# Altium project DataMergeBoard.PrjPcb
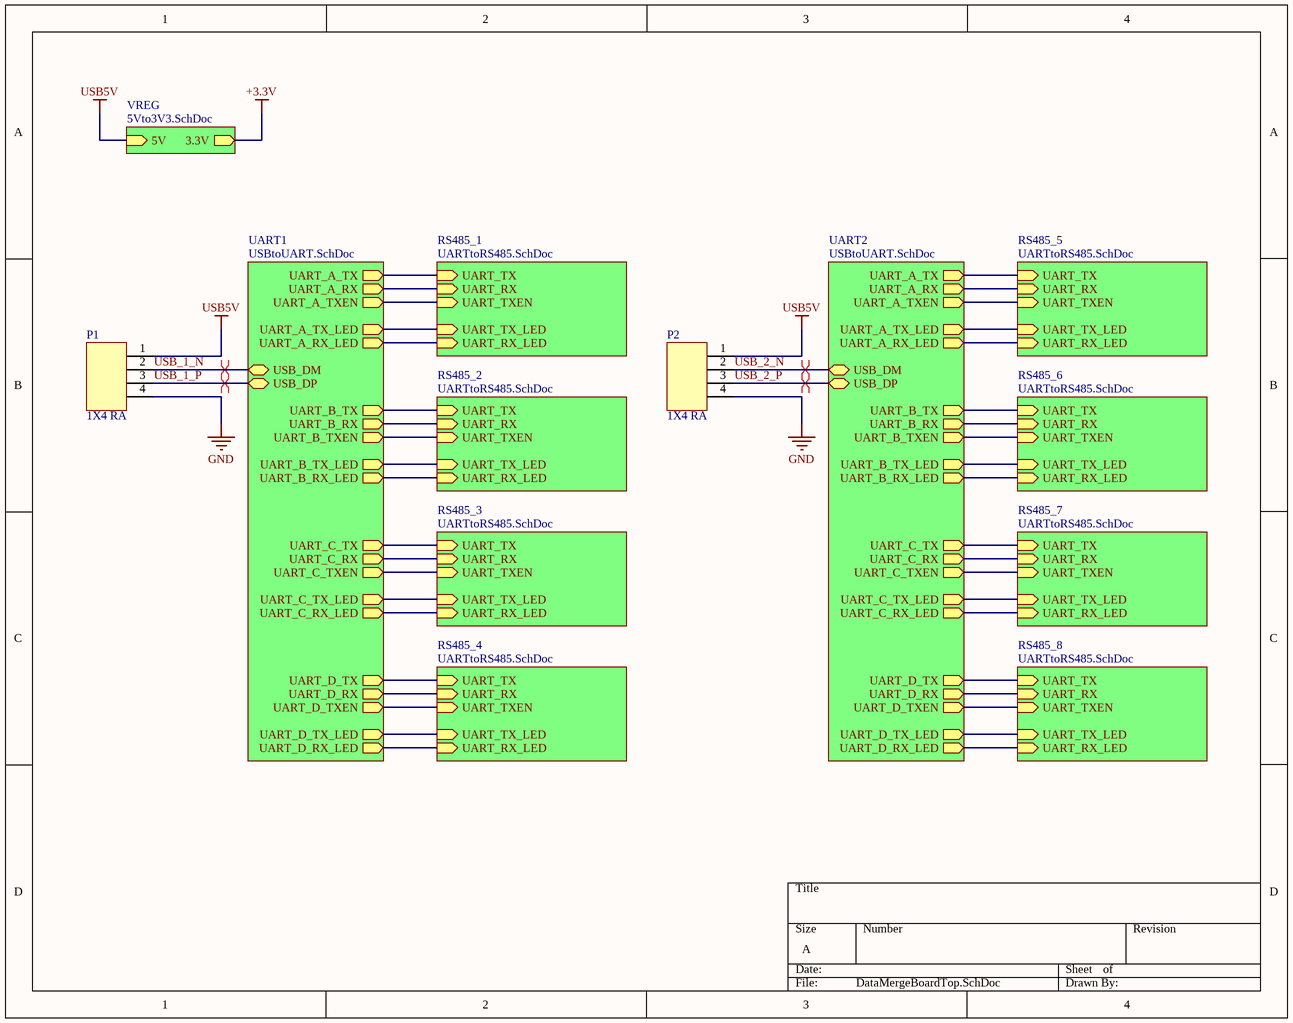
[diagram p0: DataMergeBoardTop.SchDoc]
4 sheets, 115 parts. Net scope: hierarchical (ports join the sheet entries above them; power ports are global).
Board file: DataMergeBoard.PcbDoc
Sheets:
  DataMergeBoardTop.SchDoc
    RS485_1 = UARTtoRS485.SchDoc
    UART1 = USBtoUART.SchDoc
    VREG = 5Vto3V3.SchDoc
    RS485_2 = UARTtoRS485.SchDoc
    RS485_3 = UARTtoRS485.SchDoc
    RS485_4 = UARTtoRS485.SchDoc
    RS485_5 = UARTtoRS485.SchDoc
    UART2 = USBtoUART.SchDoc
    RS485_6 = UARTtoRS485.SchDoc
    RS485_7 = UARTtoRS485.SchDoc
    RS485_8 = UARTtoRS485.SchDoc

## Sheet DataMergeBoardTop.SchDoc
size A

### Parts
P1  1X4 RA  [MOLEX-HDR-1X4-SHERLOCK-RA]
P2  1X4 RA  [MOLEX-HDR-1X4-SHERLOCK-RA]

### Sub-sheets
RS485_1 = UARTtoRS485.SchDoc: UART_TX (in), UART_RX (in), UART_TXEN (in), UART_RX_LED (in), UART_TX_LED (in)
RS485_2 = UARTtoRS485.SchDoc: UART_TX (in), UART_RX (in), UART_TXEN (in), UART_RX_LED (in), UART_TX_LED (in)
RS485_3 = UARTtoRS485.SchDoc: UART_TX (in), UART_RX (in), UART_TXEN (in), UART_RX_LED (in), UART_TX_LED (in)
RS485_4 = UARTtoRS485.SchDoc: UART_TX (in), UART_RX (in), UART_TXEN (in), UART_RX_LED (in), UART_TX_LED (in)
RS485_5 = UARTtoRS485.SchDoc: UART_TX (in), UART_RX (in), UART_TXEN (in), UART_RX_LED (in), UART_TX_LED (in)
RS485_6 = UARTtoRS485.SchDoc: UART_TX (in), UART_RX (in), UART_TXEN (in), UART_RX_LED (in), UART_TX_LED (in)
RS485_7 = UARTtoRS485.SchDoc: UART_TX (in), UART_RX (in), UART_TXEN (in), UART_RX_LED (in), UART_TX_LED (in)
RS485_8 = UARTtoRS485.SchDoc: UART_TX (in), UART_RX (in), UART_TXEN (in), UART_RX_LED (in), UART_TX_LED (in)
UART1 = USBtoUART.SchDoc: UART_A_TX (out), UART_A_RX (out), UART_A_TXEN (out), UART_B_RX (out), UART_B_TX (out), UART_B_TXEN (out), UART_C_RX (out), UART_C_TX (out), UART_C_TXEN (out), UART_D_RX (out), UART_D_TX (out), UART_D_TXEN (out), USB_DP (bidir), USB_DM (bidir), UART_A_TX_LED (out), UART_A_RX_LED (out), UART_B_TX_LED (out), UART_C_TX_LED (out), UART_D_TX_LED (out), UART_B_RX_LED (out), UART_C_RX_LED (out), UART_D_RX_LED (out)
UART2 = USBtoUART.SchDoc: UART_A_TX (out), UART_A_RX (out), UART_A_TXEN (out), UART_B_RX (out), UART_B_TX (out), UART_B_TXEN (out), UART_C_RX (out), UART_C_TX (out), UART_C_TXEN (out), UART_D_RX (out), UART_D_TX (out), UART_D_TXEN (out), USB_DM (bidir), USB_DP (bidir), UART_A_TX_LED (out), UART_A_RX_LED (out), UART_B_TX_LED (out), UART_C_TX_LED (out), UART_D_TX_LED (out), UART_B_RX_LED (out), UART_C_RX_LED (out), UART_D_RX_LED (out)
VREG = 5Vto3V3.SchDoc: 5V (in), 3.3V (out)

### Nets
GND: P1.4 P2.4
USB5V: P1.1 P2.1 ; sheet VREG/5V
USB_1_N: P1.2 ; sheet UART1/USB_DM
USB_1_P: P1.3 ; sheet UART1/USB_DP
USB_2_N: P2.2 ; sheet UART2/USB_DM
USB_2_P: P2.3 ; sheet UART2/USB_DP
NetR2_RS485_1_1: sheet RS485_1/UART_TX_LED, sheet UART1/UART_A_TX_LED
NetR2_RS485_2_1: sheet UART1/UART_B_TX_LED, sheet RS485_2/UART_TX_LED
NetR2_RS485_3_1: sheet UART1/UART_C_TX_LED, sheet RS485_3/UART_TX_LED
NetR2_RS485_4_1: sheet UART1/UART_D_TX_LED, sheet RS485_4/UART_TX_LED
NetR2_RS485_5_1: sheet RS485_5/UART_TX_LED, sheet UART2/UART_A_TX_LED
NetR2_RS485_6_1: sheet UART2/UART_B_TX_LED, sheet RS485_6/UART_TX_LED
NetR2_RS485_7_1: sheet UART2/UART_C_TX_LED, sheet RS485_7/UART_TX_LED
NetR2_RS485_8_1: sheet UART2/UART_D_TX_LED, sheet RS485_8/UART_TX_LED
NetR3_RS485_1_1: sheet RS485_1/UART_RX_LED, sheet UART1/UART_A_RX_LED
NetR3_RS485_2_1: sheet UART1/UART_B_RX_LED, sheet RS485_2/UART_RX_LED
NetR3_RS485_3_1: sheet UART1/UART_C_RX_LED, sheet RS485_3/UART_RX_LED
NetR3_RS485_4_1: sheet UART1/UART_D_RX_LED, sheet RS485_4/UART_RX_LED
NetR3_RS485_5_1: sheet RS485_5/UART_RX_LED, sheet UART2/UART_A_RX_LED
NetR3_RS485_6_1: sheet UART2/UART_B_RX_LED, sheet RS485_6/UART_RX_LED
NetR3_RS485_7_1: sheet UART2/UART_C_RX_LED, sheet RS485_7/UART_RX_LED
NetR3_RS485_8_1: sheet UART2/UART_D_RX_LED, sheet RS485_8/UART_RX_LED
NetU1_RS485_1_1: sheet RS485_1/UART_RX, sheet UART1/UART_A_RX
NetU1_RS485_1_2: sheet RS485_1/UART_TXEN, sheet UART1/UART_A_TXEN
NetU1_RS485_1_4: sheet RS485_1/UART_TX, sheet UART1/UART_A_TX
NetU1_RS485_2_1: sheet UART1/UART_B_RX, sheet RS485_2/UART_RX
NetU1_RS485_2_2: sheet UART1/UART_B_TXEN, sheet RS485_2/UART_TXEN
NetU1_RS485_2_4: sheet UART1/UART_B_TX, sheet RS485_2/UART_TX
NetU1_RS485_3_1: sheet UART1/UART_C_RX, sheet RS485_3/UART_RX
NetU1_RS485_3_2: sheet UART1/UART_C_TXEN, sheet RS485_3/UART_TXEN
NetU1_RS485_3_4: sheet UART1/UART_C_TX, sheet RS485_3/UART_TX
NetU1_RS485_4_1: sheet UART1/UART_D_RX, sheet RS485_4/UART_RX
NetU1_RS485_4_2: sheet UART1/UART_D_TXEN, sheet RS485_4/UART_TXEN
NetU1_RS485_4_4: sheet UART1/UART_D_TX, sheet RS485_4/UART_TX
NetU1_RS485_5_1: sheet RS485_5/UART_RX, sheet UART2/UART_A_RX
NetU1_RS485_5_2: sheet RS485_5/UART_TXEN, sheet UART2/UART_A_TXEN
NetU1_RS485_5_4: sheet RS485_5/UART_TX, sheet UART2/UART_A_TX
NetU1_RS485_6_1: sheet UART2/UART_B_RX, sheet RS485_6/UART_RX
NetU1_RS485_6_2: sheet UART2/UART_B_TXEN, sheet RS485_6/UART_TXEN
NetU1_RS485_6_4: sheet UART2/UART_B_TX, sheet RS485_6/UART_TX
NetU1_RS485_7_1: sheet UART2/UART_C_RX, sheet RS485_7/UART_RX
NetU1_RS485_7_2: sheet UART2/UART_C_TXEN, sheet RS485_7/UART_TXEN
NetU1_RS485_7_4: sheet UART2/UART_C_TX, sheet RS485_7/UART_TX
NetU1_RS485_8_1: sheet UART2/UART_D_RX, sheet RS485_8/UART_RX
NetU1_RS485_8_2: sheet UART2/UART_D_TXEN, sheet RS485_8/UART_TXEN
NetU1_RS485_8_4: sheet UART2/UART_D_TX, sheet RS485_8/UART_TX

### Layout directives
differential pair: USB_1_N, USB_1_P, USB_2_N, USB_2_P

### Library data of the parts
P1 P2 = MOLEX-HDR-1x4-SHERLOCK_RA: CONN HEADER 4POS 2MM R/A TIN; Supplier Part Number 1: WM18933-ND; Supplier 1: Digi-Key

## Sheet UARTtoRS485.SchDoc
size A
Used 8 times, as channels RS485_1, RS485_2, RS485_3, RS485_4, RS485_5, RS485_6, RS485_7, RS485_8. Parts and nets are listed once, with the designators drawn on the sheet.
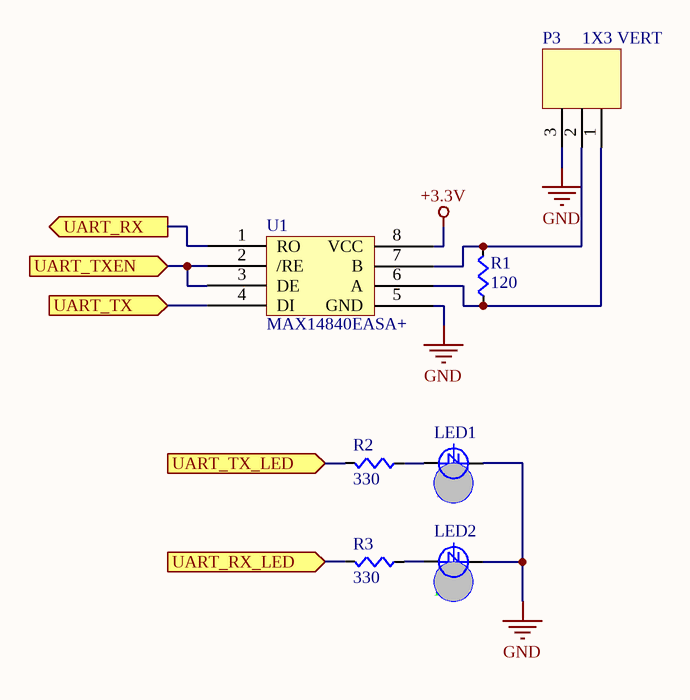
[diagram p1: UARTtoRS485.SchDoc]

### Parts
LED1  Color: TX  [LED0603]  (hidden comment: LED)
LED2  Color: RX  [LED0603]  (hidden comment: LED)
P3  1X3 VERT  [MOLEX-HDR-1X3-SHERLOCK-VERT]
R1  value 120  [RES0603]  (hidden comment: Res)
R2  value 330  [RES0603]  (hidden comment: Res)
R3  value 330  [RES0603]  (hidden comment: Res)
U1  MAX14840EASA+  [MAX14840EASA+]

### Ports
UART_RX (out), UART_RX_LED (in), UART_TX (in), UART_TX_LED (in), UART_TXEN (in)

### Nets
+3.3V: U1.8(VCC)
GND: LED1.C LED2.C P3.3 U1.5(GND)
UART_RX: U1.1(RO) ; port UART_RX
UART_RX_LED: R3.1(A) ; port UART_RX_LED
UART_TX: U1.4(DI) ; port UART_TX
UART_TX_LED: R2.1(A) ; port UART_TX_LED
UART_TXEN: U1.2(/RE) U1.3(DE) ; port UART_TXEN
NetLED1_A: LED1.A R2.2(B)
NetLED2_A: LED2.A R3.2(B)
NetP3_1: P3.1 R1.2(B) U1.6(A)
NetP3_2: P3.2 R1.1(A) U1.7(B)

### Channels
RS485_1: designators end in _RS485_1; ports UART_RX=NetU1_RS485_1_1 UART_RX_LED=NetR3_RS485_1_1 UART_TX=NetU1_RS485_1_4 UART_TX_LED=NetR2_RS485_1_1 UART_TXEN=NetU1_RS485_1_2
RS485_2: designators end in _RS485_2; ports UART_RX=NetU1_RS485_2_1 UART_RX_LED=NetR3_RS485_2_1 UART_TX=NetU1_RS485_2_4 UART_TX_LED=NetR2_RS485_2_1 UART_TXEN=NetU1_RS485_2_2
RS485_3: designators end in _RS485_3; ports UART_RX=NetU1_RS485_3_1 UART_RX_LED=NetR3_RS485_3_1 UART_TX=NetU1_RS485_3_4 UART_TX_LED=NetR2_RS485_3_1 UART_TXEN=NetU1_RS485_3_2
RS485_4: designators end in _RS485_4; ports UART_RX=NetU1_RS485_4_1 UART_RX_LED=NetR3_RS485_4_1 UART_TX=NetU1_RS485_4_4 UART_TX_LED=NetR2_RS485_4_1 UART_TXEN=NetU1_RS485_4_2
RS485_5: designators end in _RS485_5; ports UART_RX=NetU1_RS485_5_1 UART_RX_LED=NetR3_RS485_5_1 UART_TX=NetU1_RS485_5_4 UART_TX_LED=NetR2_RS485_5_1 UART_TXEN=NetU1_RS485_5_2
RS485_6: designators end in _RS485_6; ports UART_RX=NetU1_RS485_6_1 UART_RX_LED=NetR3_RS485_6_1 UART_TX=NetU1_RS485_6_4 UART_TX_LED=NetR2_RS485_6_1 UART_TXEN=NetU1_RS485_6_2
RS485_7: designators end in _RS485_7; ports UART_RX=NetU1_RS485_7_1 UART_RX_LED=NetR3_RS485_7_1 UART_TX=NetU1_RS485_7_4 UART_TX_LED=NetR2_RS485_7_1 UART_TXEN=NetU1_RS485_7_2
RS485_8: designators end in _RS485_8; ports UART_RX=NetU1_RS485_8_1 UART_RX_LED=NetR3_RS485_8_1 UART_TX=NetU1_RS485_8_4 UART_TX_LED=NetR2_RS485_8_1 UART_TXEN=NetU1_RS485_8_2

### Library data of the parts
LED1 = LED: LED RED CLEAR 0603 SMD; Supplier 1: Digi-Key; Supplier Part Number 1: 754-1123-1-ND
LED2 = LED: LED GREEN CLEAR 0603 SMD; Supplier 1: Digi-Key; Supplier Part Number 1: 754-1116-1-ND
P3 = MOLEX-HDR-1x3-SHERLOCK_VERT: CONN HEADER 3POS 2MM VERT TIN; Supplier Part Number 1: WM18921-ND; Supplier 1: Digi-Key
R1 = Res: RES SMD 120 OHM 1% 1/10W 0603; Supplier 1: Digi-Key; Supplier Part Number 1: 311-120HRCT-ND
R2 R3 = Res: RES SMD 330 OHM 1% 1/10W 0603; Supplier 1: Digi-Key; Supplier Part Number 1: 311-330HRCT-ND
U1 = MAX14840EASA+: IC TXRX RS422/485 40MBPS 8SOIC; Supplier 1: Digi-Key; Supplier Part Number 1: MAX14840EASA+-ND

## Sheet USBtoUART.SchDoc
size A
Used 2 times, as channels UART1, UART2. Parts and nets are listed once, with the designators drawn on the sheet.
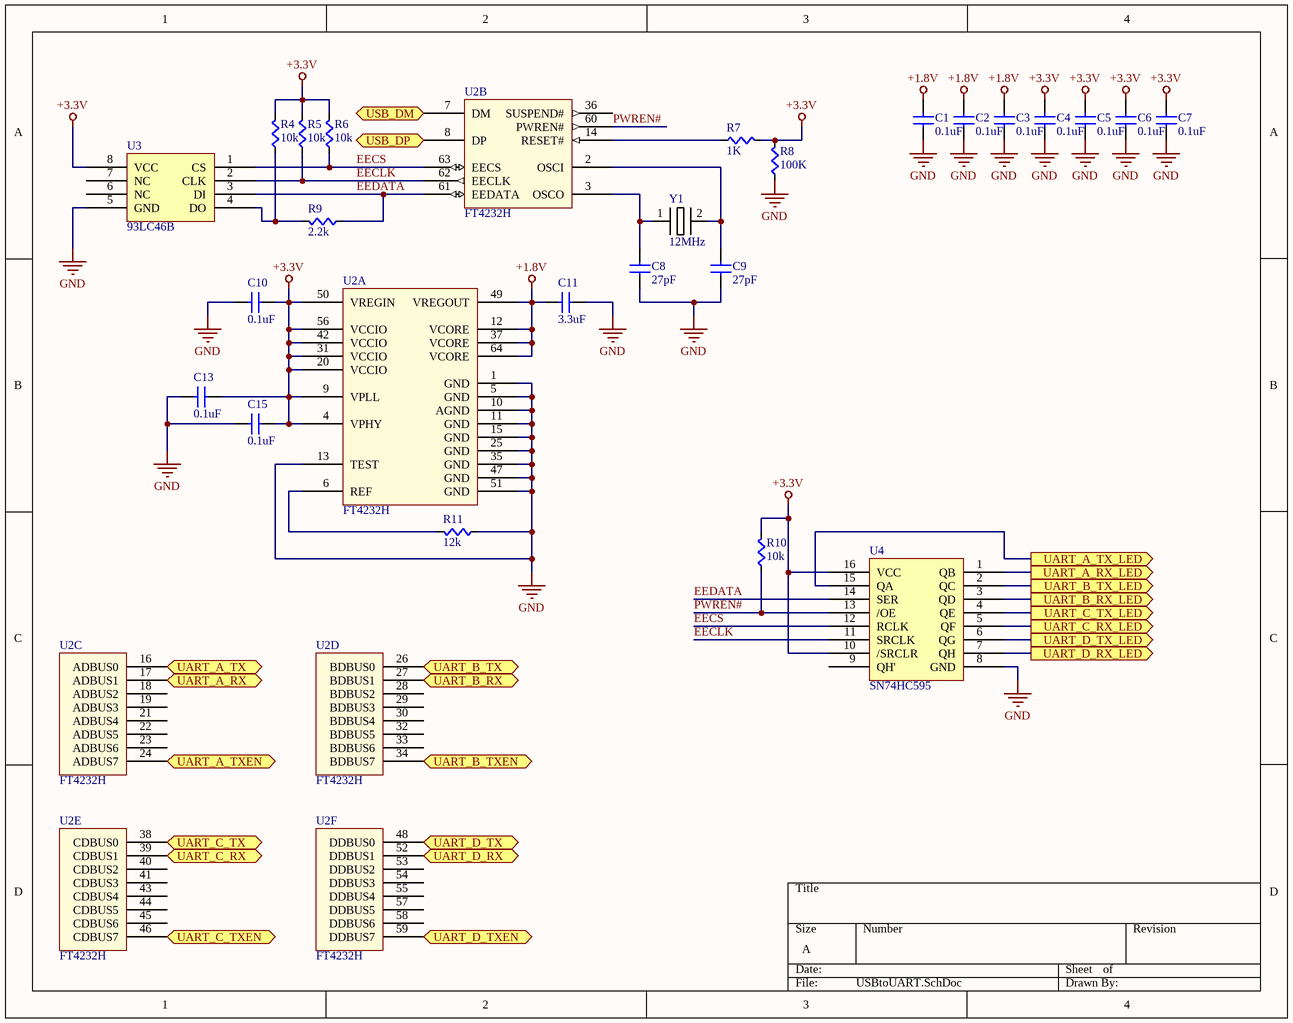
[diagram p2: USBtoUART.SchDoc]

### Parts
C1  value 0.1uF  [CAPC0603]  (hidden comment: Cap)
C2  value 0.1uF  [CAPC0603]  (hidden comment: Cap)
C3  value 0.1uF  [CAPC0603]  (hidden comment: Cap)
C4  value 0.1uF  [CAPC0603]  (hidden comment: Cap)
C5  value 0.1uF  [CAPC0603]  (hidden comment: Cap)
C6  value 0.1uF  [CAPC0603]  (hidden comment: Cap)
C7  value 0.1uF  [CAPC0603]  (hidden comment: Cap)
C8  value 27pF  [CAPC0603]  (hidden comment: Cap)
C9  value 27pF  [CAPC0603]  (hidden comment: Cap)
C10  value 0.1uF  [CAPC0603]  (hidden comment: Cap)
C11  value 3.3uF  [CAPC0603]  (hidden comment: Cap)
C13  value 0.1uF  [CAPC0603]  (hidden comment: Cap)
C15  value 0.1uF  [CAPC0603]  (hidden comment: Cap)
R4  value 10k  [RES0603]  (hidden comment: Res)
R5  value 10k  [RES0603]  (hidden comment: Res)
R6  value 10k  [RES0603]  (hidden comment: Res)
R7  value 1K  [RES0603]  (hidden comment: Res)
R8  value 100K  [RES0603]  (hidden comment: Res)
R9  value 2.2k  [RES0603]  (hidden comment: Res)
R10  value 10k  [RES0603]  (hidden comment: Res)
R11  value 12k  [RES0603]  (hidden comment: Res)
U2  FT4232H  [FT4232HL]  (parts A,B,C,D,E,F of 6)
U3  93LC46B  [SOIC-8pin]
U4  SN74HC595  [TSSOP-16pin]
Y1  12MHz  [HC49/US]

### Ports
UART_A_RX (in), UART_A_RX_LED (out), UART_A_TX (out), UART_A_TX_LED (out), UART_A_TXEN (out), UART_B_RX (in), UART_B_RX_LED (out), UART_B_TX (out), UART_B_TX_LED (out), UART_B_TXEN (out), UART_C_RX (in), UART_C_RX_LED (out), UART_C_TX (out), UART_C_TX_LED (out), UART_C_TXEN (out), UART_D_RX (in), UART_D_RX_LED (out), UART_D_TX (out), UART_D_TX_LED (out), UART_D_TXEN (out), USB_DM (bidir), USB_DP (bidir)

### Nets
+1.8V: C1.2(B) C2.2(B) C3.2(B) C11.1(A) U2.12(VCORE) U2.37(VCORE) U2.49(VREGOUT) U2.64(VCORE)
+3.3V: C4.2(B) C5.2(B) C6.2(B) C7.2(B) C10.2(B) C13.2(B) C15.1(A) R4.1(A) R5.1(A) R6.1(A) R7.1(A) R8.1(A) R10.1(A) U2.4(VPHY) U2.9(VPLL) U2.20(VCCIO) U2.31(VCCIO) U2.42(VCCIO) U2.50(VREGIN) U2.56(VCCIO) U3.8(VCC) U4.10(/SRCLR) U4.16(VCC)
GND: C1.1(A) C2.1(A) C3.1(A) C4.1(A) C5.1(A) C6.1(A) C7.1(A) C8.2(B) C9.2(B) C10.1(A) C11.2(B) C13.1(A) C15.2(B) R8.2(B) R11.2(B) U2.1(GND) U2.5(GND) U2.10(AGND) U2.11(GND) U2.13(TEST) U2.15(GND) U2.25(GND) U2.35(GND) U2.47(GND) U2.51(GND) U3.5(GND) U4.8(GND)
EECLK: R5.2(B) U2.62(EECLK) U3.2(CLK) U4.11(SRCLK)
EECS: R6.2(B) U2.63(EECS) U3.1(CS) U4.12(RCLK)
EEDATA: R9.2(B) U2.61(EEDATA) U3.3(DI) U4.14(SER)
PWREN#: R10.2(B) U2.60(PWREN#) U4.13(/OE)
UART_A_RX: U2.17(ADBUS1) ; port UART_A_RX
UART_A_RX_LED: U4.1(QB) ; port UART_A_RX_LED
UART_A_TX: U2.16(ADBUS0) ; port UART_A_TX
UART_A_TX_LED: U4.15(QA) ; port UART_A_TX_LED
UART_A_TXEN: U2.24(ADBUS7) ; port UART_A_TXEN
UART_B_RX: U2.27(BDBUS1) ; port UART_B_RX
UART_B_RX_LED: U4.3(QD) ; port UART_B_RX_LED
UART_B_TX: U2.26(BDBUS0) ; port UART_B_TX
UART_B_TX_LED: U4.2(QC) ; port UART_B_TX_LED
UART_B_TXEN: U2.34(BDBUS7) ; port UART_B_TXEN
UART_C_RX: U2.39(CDBUS1) ; port UART_C_RX
UART_C_RX_LED: U4.5(QF) ; port UART_C_RX_LED
UART_C_TX: U2.38(CDBUS0) ; port UART_C_TX
UART_C_TX_LED: U4.4(QE) ; port UART_C_TX_LED
UART_C_TXEN: U2.46(CDBUS7) ; port UART_C_TXEN
UART_D_RX: U2.52(DDBUS1) ; port UART_D_RX
UART_D_RX_LED: U4.7(QH) ; port UART_D_RX_LED
UART_D_TX: U2.48(DDBUS0) ; port UART_D_TX
UART_D_TX_LED: U4.6(QG) ; port UART_D_TX_LED
UART_D_TXEN: U2.59(DDBUS7) ; port UART_D_TXEN
USB_DM: U2.7(DM) ; port USB_DM
USB_DP: U2.8(DP) ; port USB_DP
NetC8_1: C8.1(A) U2.3(OSCO) Y1.1
NetC9_1: C9.1(A) U2.2(OSCI) Y1.2
NetR4_2: R4.2(B) R9.1(A) U3.4(DO)
NetR7_2: R7.2(B) U2.14(RESET#)
NetR11_1: R11.1(A) U2.6(REF)

Not connected (* = marked no-connect by the designer): U2 18(ADBUS2) 19(ADBUS3) 21(ADBUS4) 22(ADBUS5) 23(ADBUS6) 28(BDBUS2) 29(BDBUS3) 30(BDBUS4) 32(BDBUS5) 33(BDBUS6) 36(SUSPEND#) 40(CDBUS2) 41(CDBUS3) 43(CDBUS4) 44(CDBUS5) 45(CDBUS6) 53(DDBUS2) 54(DDBUS3) 55(DDBUS4) 57(DDBUS5) 58(DDBUS6); U3 6(NC) 7(NC); U4 9(QH')

### Channels
UART1: designators end in _UART1; ports UART_A_RX=NetU1_RS485_1_1 UART_A_RX_LED=NetR3_RS485_1_1 UART_A_TX=NetU1_RS485_1_4 UART_A_TX_LED=NetR2_RS485_1_1 UART_A_TXEN=NetU1_RS485_1_2 UART_B_RX=NetU1_RS485_2_1 UART_B_RX_LED=NetR3_RS485_2_1 UART_B_TX=NetU1_RS485_2_4 UART_B_TX_LED=NetR2_RS485_2_1 UART_B_TXEN=NetU1_RS485_2_2 UART_C_RX=NetU1_RS485_3_1 UART_C_RX_LED=NetR3_RS485_3_1 UART_C_TX=NetU1_RS485_3_4 UART_C_TX_LED=NetR2_RS485_3_1 UART_C_TXEN=NetU1_RS485_3_2 UART_D_RX=NetU1_RS485_4_1 UART_D_RX_LED=NetR3_RS485_4_1 UART_D_TX=NetU1_RS485_4_4 UART_D_TX_LED=NetR2_RS485_4_1 UART_D_TXEN=NetU1_RS485_4_2 USB_DM=USB_1_N USB_DP=USB_1_P
UART2: designators end in _UART2; ports UART_A_RX=NetU1_RS485_5_1 UART_A_RX_LED=NetR3_RS485_5_1 UART_A_TX=NetU1_RS485_5_4 UART_A_TX_LED=NetR2_RS485_5_1 UART_A_TXEN=NetU1_RS485_5_2 UART_B_RX=NetU1_RS485_6_1 UART_B_RX_LED=NetR3_RS485_6_1 UART_B_TX=NetU1_RS485_6_4 UART_B_TX_LED=NetR2_RS485_6_1 UART_B_TXEN=NetU1_RS485_6_2 UART_C_RX=NetU1_RS485_7_1 UART_C_RX_LED=NetR3_RS485_7_1 UART_C_TX=NetU1_RS485_7_4 UART_C_TX_LED=NetR2_RS485_7_1 UART_C_TXEN=NetU1_RS485_7_2 UART_D_RX=NetU1_RS485_8_1 UART_D_RX_LED=NetR3_RS485_8_1 UART_D_TX=NetU1_RS485_8_4 UART_D_TX_LED=NetR2_RS485_8_1 UART_D_TXEN=NetU1_RS485_8_2 USB_DM=USB_2_N USB_DP=USB_2_P

### Library data of the parts
C1-C7 C10 C13 C15 = Cap: CAP CER 0.1UF 50V X7R 0603; Supplier 1: Digi-Key; Supplier Part Number 1: 1276-1000-1-ND
C8 C9 = Cap: CAP CER 27PF 50V NP0 0603; Supplier 1: Digi-Key; Supplier Part Number 1: 490-1413-1-ND
C11 = Cap: CAP CER 3.3UF 16V X5R 0603; Supplier 1: Digi-Key; Supplier Part Number 1: 445-7476-1-ND
R4-R6 R10 = Res: RES SMD 10K OHM 1% 1/10W 0603; Supplier 1: Digi-Key; Supplier Part Number 1: 311-10.0KHRCT-ND
R7 = Res: RES SMD 1K OHM 1% 1/10W 0603; Supplier 1: Digi-Key; Supplier Part Number 1: 311-1.00KHRCT-ND
R8 = Res: RES SMD 100K OHM 1% 1/10W 0603; Supplier 1: Digi-Key; Supplier Part Number 1: 311-100KHRCT-ND
R9 = Res: RES SMD 2.2K OHM 1% 1/10W 0603; Supplier 1: Digi-Key; Supplier Part Number 1: 311-2.20KHRCT-ND
R11 = Res: RES SMD 12K OHM 1% 1/10W 0603; Supplier 1: Digi-Key; Supplier Part Number 1: 311-12.0KHRCT-ND
U2 = FT4232H: IC USB HS QUAD UART/SYNC 64-LQFP; Supplier 1: Digi-Key; Supplier Part Number 1: 768-1026-1-ND
U3 = 93LC46B: IC EEPROM 1KBIT 2MHZ 8SOIC; Supplier 1: Digi-Key; Supplier Part Number 1: 93LC46BT-I/SNCT-ND
U4 = SN74HC595: IC 8BIT SHIFT REGISTER 16-TSSOP; Supplier 1: Digi-Key; Supplier Part Number 1: 296-23258-1-ND
Y1 = ABLS2-12.000MHZ-D4Y-T: CRYSTAL 12.0000MHZ 18PF SMD; Supplier 1: Digi-Key; Supplier Part Number 1: 535-9869-1-ND

## Sheet 5Vto3V3.SchDoc
size A
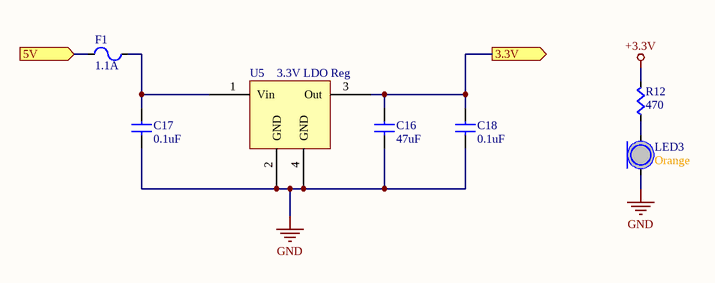
[diagram p3: 5Vto3V3.SchDoc]

### Parts
C16  value 47uF  [CAPC1206]  (hidden comment: Cap)
C17  value 0.1uF  [CAPC0603]  (hidden comment: Cap)
C18  value 0.1uF  [CAPC0603]  (hidden comment: Cap)
F1  value 1.1A  [PTC7451X11N]  (hidden comment: PTC Fuse)
LED3  Color: Orange  [LED0603]  (hidden comment: LED)
R12  value 470  [RES0603]  (hidden comment: Res)
U5  3.3V LDO Reg  [SOT23-4n]

### Ports
3.3V (out), 5V (in)

### Nets
+3.3V: C16.2(B) C18.1(A) R12.1(A) U5.3(Out) ; port 3.3V
GND: C16.1(A) C17.2(B) C18.2(B) LED3.C U5.2(GND) U5.4(GND)
USB5V: F1.1(A) ; port 5V
NetC17_1: C17.1(A) F1.2(B) U5.1(Vin)
NetLED3_A: LED3.A R12.2(B)

### Library data of the parts
C16 = Cap: CAP CER 47UF 10V X5R 1206; Supplier 1: Digi-Key; Supplier Part Number 1: 399-5508-1-ND
C17 C18 = Cap: CAP CER 0.1UF 50V X7R 0603; Supplier 1: Digi-Key; Supplier Part Number 1: 1276-1000-1-ND
F1 = PTC_Fuse: PTC RESTTBLE 33V 1.10A CHIP 2920; Supplier 1: Digi-Key; Supplier Part Number 1: 507-1744-1-ND
LED3 = LED: LED ORANGE CLEAR 0603 SMD; Supplier 1: Digi-Key; Supplier Part Number 1: 754-1120-1-ND
R12 = Res: RES SMD 470 OHM 1% 1/10W 0603; Supplier 1: Digi-Key; Supplier Part Number 1: 311-470HRCT-ND
U5 = LM3940IMPX-3.3: IC REG LDO 3.3V 1A SOT223; Supplier 1: Digi-Key; Supplier Part Number 1: LM3940IMPX-3.3/NOPBCT-ND

## Nets that join several sheets
+1.8V: UART1 (8 pins), UART2 (8 pins)
+3.3V: RS485_1 (U1_RS485_1.8), UART1 (23 pins), 5Vto3V3 (C16.2 C18.1 R12.1 U5.3), RS485_2 (U1_RS485_2.8), RS485_3 (U1_RS485_3.8), RS485_4 (U1_RS485_4.8), RS485_5 (U1_RS485_5.8), UART2 (23 pins), RS485_6 (U1_RS485_6.8), RS485_7 (U1_RS485_7.8), RS485_8 (U1_RS485_8.8)
GND: DataMergeBoardTop (P1.4 P2.4), RS485_1 (LED1_RS485_1.C LED2_RS485_1.C P3_RS485_1.3 U1_RS485_1.5), UART1 (27 pins), 5Vto3V3 (6 pins), RS485_2 (LED1_RS485_2.C LED2_RS485_2.C P3_RS485_2.3 U1_RS485_2.5), RS485_3 (LED1_RS485_3.C LED2_RS485_3.C P3_RS485_3.3 U1_RS485_3.5), RS485_4 (LED1_RS485_4.C LED2_RS485_4.C P3_RS485_4.3 U1_RS485_4.5), RS485_5 (LED1_RS485_5.C LED2_RS485_5.C P3_RS485_5.3 U1_RS485_5.5), UART2 (27 pins), RS485_6 (LED1_RS485_6.C LED2_RS485_6.C P3_RS485_6.3 U1_RS485_6.5), RS485_7 (LED1_RS485_7.C LED2_RS485_7.C P3_RS485_7.3 U1_RS485_7.5), RS485_8 (LED1_RS485_8.C LED2_RS485_8.C P3_RS485_8.3 U1_RS485_8.5)
USB5V: DataMergeBoardTop (P1.1 P2.1), 5Vto3V3 (F1.1)
NetR2_RS485_1_1: RS485_1 (R2_RS485_1.1), UART1 (U4_UART1.15)
NetR2_RS485_2_1: UART1 (U4_UART1.2), RS485_2 (R2_RS485_2.1)
NetR2_RS485_3_1: UART1 (U4_UART1.4), RS485_3 (R2_RS485_3.1)
NetR2_RS485_4_1: UART1 (U4_UART1.6), RS485_4 (R2_RS485_4.1)
NetR2_RS485_5_1: RS485_5 (R2_RS485_5.1), UART2 (U4_UART2.15)
NetR2_RS485_6_1: UART2 (U4_UART2.2), RS485_6 (R2_RS485_6.1)
NetR2_RS485_7_1: UART2 (U4_UART2.4), RS485_7 (R2_RS485_7.1)
NetR2_RS485_8_1: UART2 (U4_UART2.6), RS485_8 (R2_RS485_8.1)
NetR3_RS485_1_1: RS485_1 (R3_RS485_1.1), UART1 (U4_UART1.1)
NetR3_RS485_2_1: UART1 (U4_UART1.3), RS485_2 (R3_RS485_2.1)
NetR3_RS485_3_1: UART1 (U4_UART1.5), RS485_3 (R3_RS485_3.1)
NetR3_RS485_4_1: UART1 (U4_UART1.7), RS485_4 (R3_RS485_4.1)
NetR3_RS485_5_1: RS485_5 (R3_RS485_5.1), UART2 (U4_UART2.1)
NetR3_RS485_6_1: UART2 (U4_UART2.3), RS485_6 (R3_RS485_6.1)
NetR3_RS485_7_1: UART2 (U4_UART2.5), RS485_7 (R3_RS485_7.1)
NetR3_RS485_8_1: UART2 (U4_UART2.7), RS485_8 (R3_RS485_8.1)
NetU1_RS485_1_1: RS485_1 (U1_RS485_1.1), UART1 (U2_UART1.17)
NetU1_RS485_1_2: RS485_1 (U1_RS485_1.2 U1_RS485_1.3), UART1 (U2_UART1.24)
NetU1_RS485_1_4: RS485_1 (U1_RS485_1.4), UART1 (U2_UART1.16)
NetU1_RS485_2_1: UART1 (U2_UART1.27), RS485_2 (U1_RS485_2.1)
NetU1_RS485_2_2: UART1 (U2_UART1.34), RS485_2 (U1_RS485_2.2 U1_RS485_2.3)
NetU1_RS485_2_4: UART1 (U2_UART1.26), RS485_2 (U1_RS485_2.4)
NetU1_RS485_3_1: UART1 (U2_UART1.39), RS485_3 (U1_RS485_3.1)
NetU1_RS485_3_2: UART1 (U2_UART1.46), RS485_3 (U1_RS485_3.2 U1_RS485_3.3)
NetU1_RS485_3_4: UART1 (U2_UART1.38), RS485_3 (U1_RS485_3.4)
NetU1_RS485_4_1: UART1 (U2_UART1.52), RS485_4 (U1_RS485_4.1)
NetU1_RS485_4_2: UART1 (U2_UART1.59), RS485_4 (U1_RS485_4.2 U1_RS485_4.3)
NetU1_RS485_4_4: UART1 (U2_UART1.48), RS485_4 (U1_RS485_4.4)
NetU1_RS485_5_1: RS485_5 (U1_RS485_5.1), UART2 (U2_UART2.17)
NetU1_RS485_5_2: RS485_5 (U1_RS485_5.2 U1_RS485_5.3), UART2 (U2_UART2.24)
NetU1_RS485_5_4: RS485_5 (U1_RS485_5.4), UART2 (U2_UART2.16)
NetU1_RS485_6_1: UART2 (U2_UART2.27), RS485_6 (U1_RS485_6.1)
NetU1_RS485_6_2: UART2 (U2_UART2.34), RS485_6 (U1_RS485_6.2 U1_RS485_6.3)
NetU1_RS485_6_4: UART2 (U2_UART2.26), RS485_6 (U1_RS485_6.4)
NetU1_RS485_7_1: UART2 (U2_UART2.39), RS485_7 (U1_RS485_7.1)
NetU1_RS485_7_2: UART2 (U2_UART2.46), RS485_7 (U1_RS485_7.2 U1_RS485_7.3)
NetU1_RS485_7_4: UART2 (U2_UART2.38), RS485_7 (U1_RS485_7.4)
NetU1_RS485_8_1: UART2 (U2_UART2.52), RS485_8 (U1_RS485_8.1)
NetU1_RS485_8_2: UART2 (U2_UART2.59), RS485_8 (U1_RS485_8.2 U1_RS485_8.3)
NetU1_RS485_8_4: UART2 (U2_UART2.48), RS485_8 (U1_RS485_8.4)
USB_1_N: DataMergeBoardTop (P1.2), UART1 (U2_UART1.7)
USB_1_P: DataMergeBoardTop (P1.3), UART1 (U2_UART1.8)
USB_2_N: DataMergeBoardTop (P2.2), UART2 (U2_UART2.7)
USB_2_P: DataMergeBoardTop (P2.3), UART2 (U2_UART2.8)